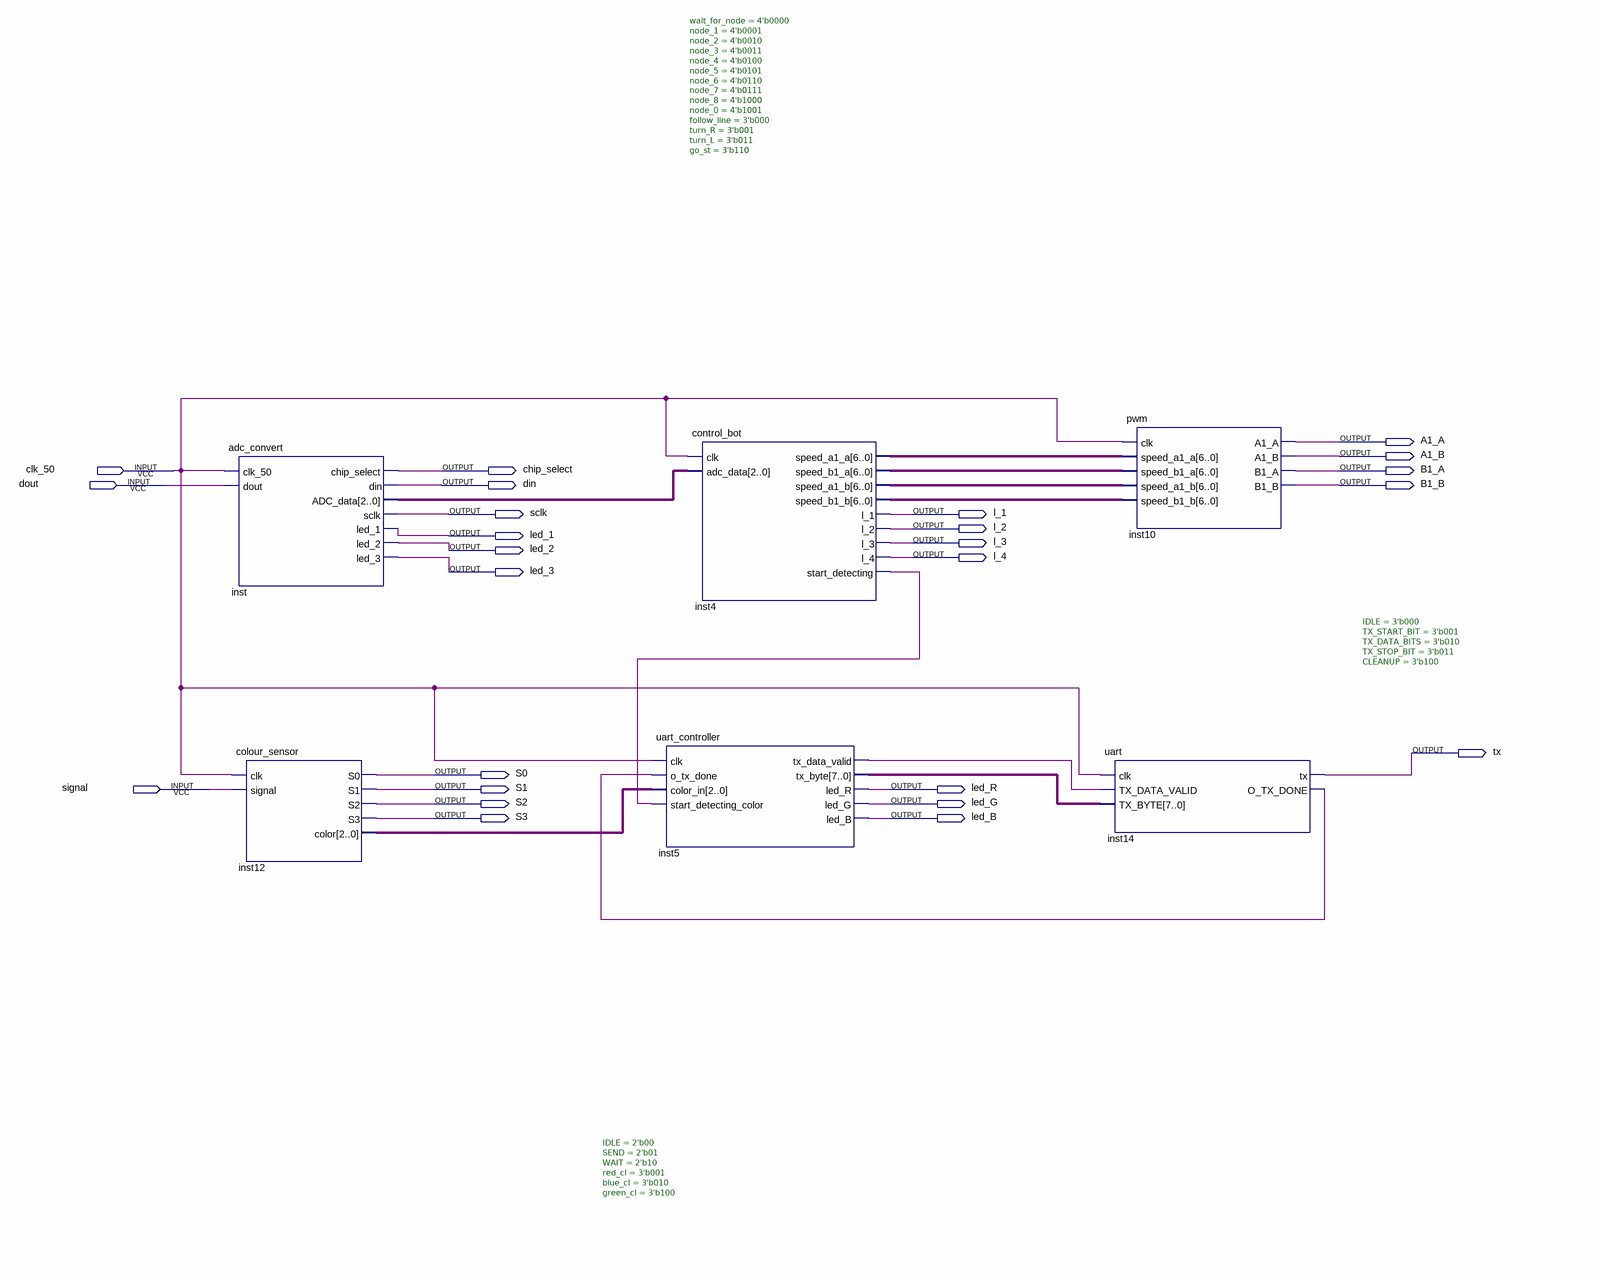
[diagram p0: schematic sheet]
// Quartus schematic SM1038_block_diagram.bdf as structural Verilog: 6 symbols, 25 pins
module SM1038_block_diagram (
  input  clk_50,
  input  dout,
  input  signal,
  output A1_A,
  output A1_B,
  output chip_select,
  output B1_A,
  output din,
  output B1_B,
  output sclk,
  output l_1,
  output l_2,
  output led_1,
  output l_3,
  output led_2,
  output l_4,
  output led_3,
  output tx,
  output S0,
  output S1,
  output led_R,
  output S2,
  output led_G,
  output S3,
  output led_B
);

  wire inst4_start_detecting, inst5_tx_data_valid, inst14_o_tx_done;
  wire [2:0] inst12_color, inst_adc_data;
  wire [6:0] inst4_speed_a1_a, inst4_speed_a1_b, inst4_speed_b1_a, inst4_speed_b1_b;
  wire [7:0] inst5_tx_byte;

  adc_convert inst (
    .clk_50(clk_50), .dout(dout), .chip_select(chip_select), .din(din), .ADC_data(inst_adc_data),
    .sclk(sclk), .led_1(led_1), .led_2(led_2), .led_3(led_3));
  colour_sensor inst12 (.clk(clk_50), .signal(signal), .S0(S0), .S1(S1), .S2(S2), .S3(S3), .color(inst12_color));
  control_bot #(.wait_for_node(4'b0000), .node_1(4'b0001), .node_2(4'b0010), .node_3(4'b0011), .node_4(4'b0100), .node_5(4'b0101), .node_6(4'b0110), .node_7(4'b0111), .node_8(4'b1000), .node_0(4'b1001), .follow_line(3'b000), .turn_R(3'b001), .turn_L(3'b011), .go_st(3'b110)) inst4 (
    .clk(clk_50), .adc_data(inst_adc_data), .speed_a1_a(inst4_speed_a1_a), .speed_b1_a(inst4_speed_b1_a),
    .speed_a1_b(inst4_speed_a1_b), .speed_b1_b(inst4_speed_b1_b), .l_1(l_1), .l_2(l_2), .l_3(l_3), .l_4(l_4),
    .start_detecting(inst4_start_detecting));
  uart_controller #(.IDLE(2'b00), .SEND(2'b01), .WAIT(2'b10), .red_cl(3'b001), .blue_cl(3'b010), .green_cl(3'b100)) inst5 (
    .clk(clk_50), .o_tx_done(inst14_o_tx_done), .color_in(inst12_color),
    .start_detecting_color(inst4_start_detecting), .tx_data_valid(inst5_tx_data_valid),
    .tx_byte(inst5_tx_byte), .led_R(led_R), .led_G(led_G), .led_B(led_B));
  uart #(.IDLE(3'b000), .TX_START_BIT(3'b001), .TX_DATA_BITS(3'b010), .TX_STOP_BIT(3'b011), .CLEANUP(3'b100)) inst14 (
    .clk(clk_50), .TX_DATA_VALID(inst5_tx_data_valid), .TX_BYTE(inst5_tx_byte), .tx(tx),
    .O_TX_DONE(inst14_o_tx_done));
  pwm inst10 (
    .clk(clk_50), .speed_a1_a(inst4_speed_a1_a), .speed_b1_a(inst4_speed_b1_a),
    .speed_a1_b(inst4_speed_a1_b), .speed_b1_b(inst4_speed_b1_b), .A1_A(A1_A), .A1_B(A1_B), .B1_A(B1_A),
    .B1_B(B1_B));
endmodule
